# EAGLE design JOYSW (EAGLE 9.2.2)
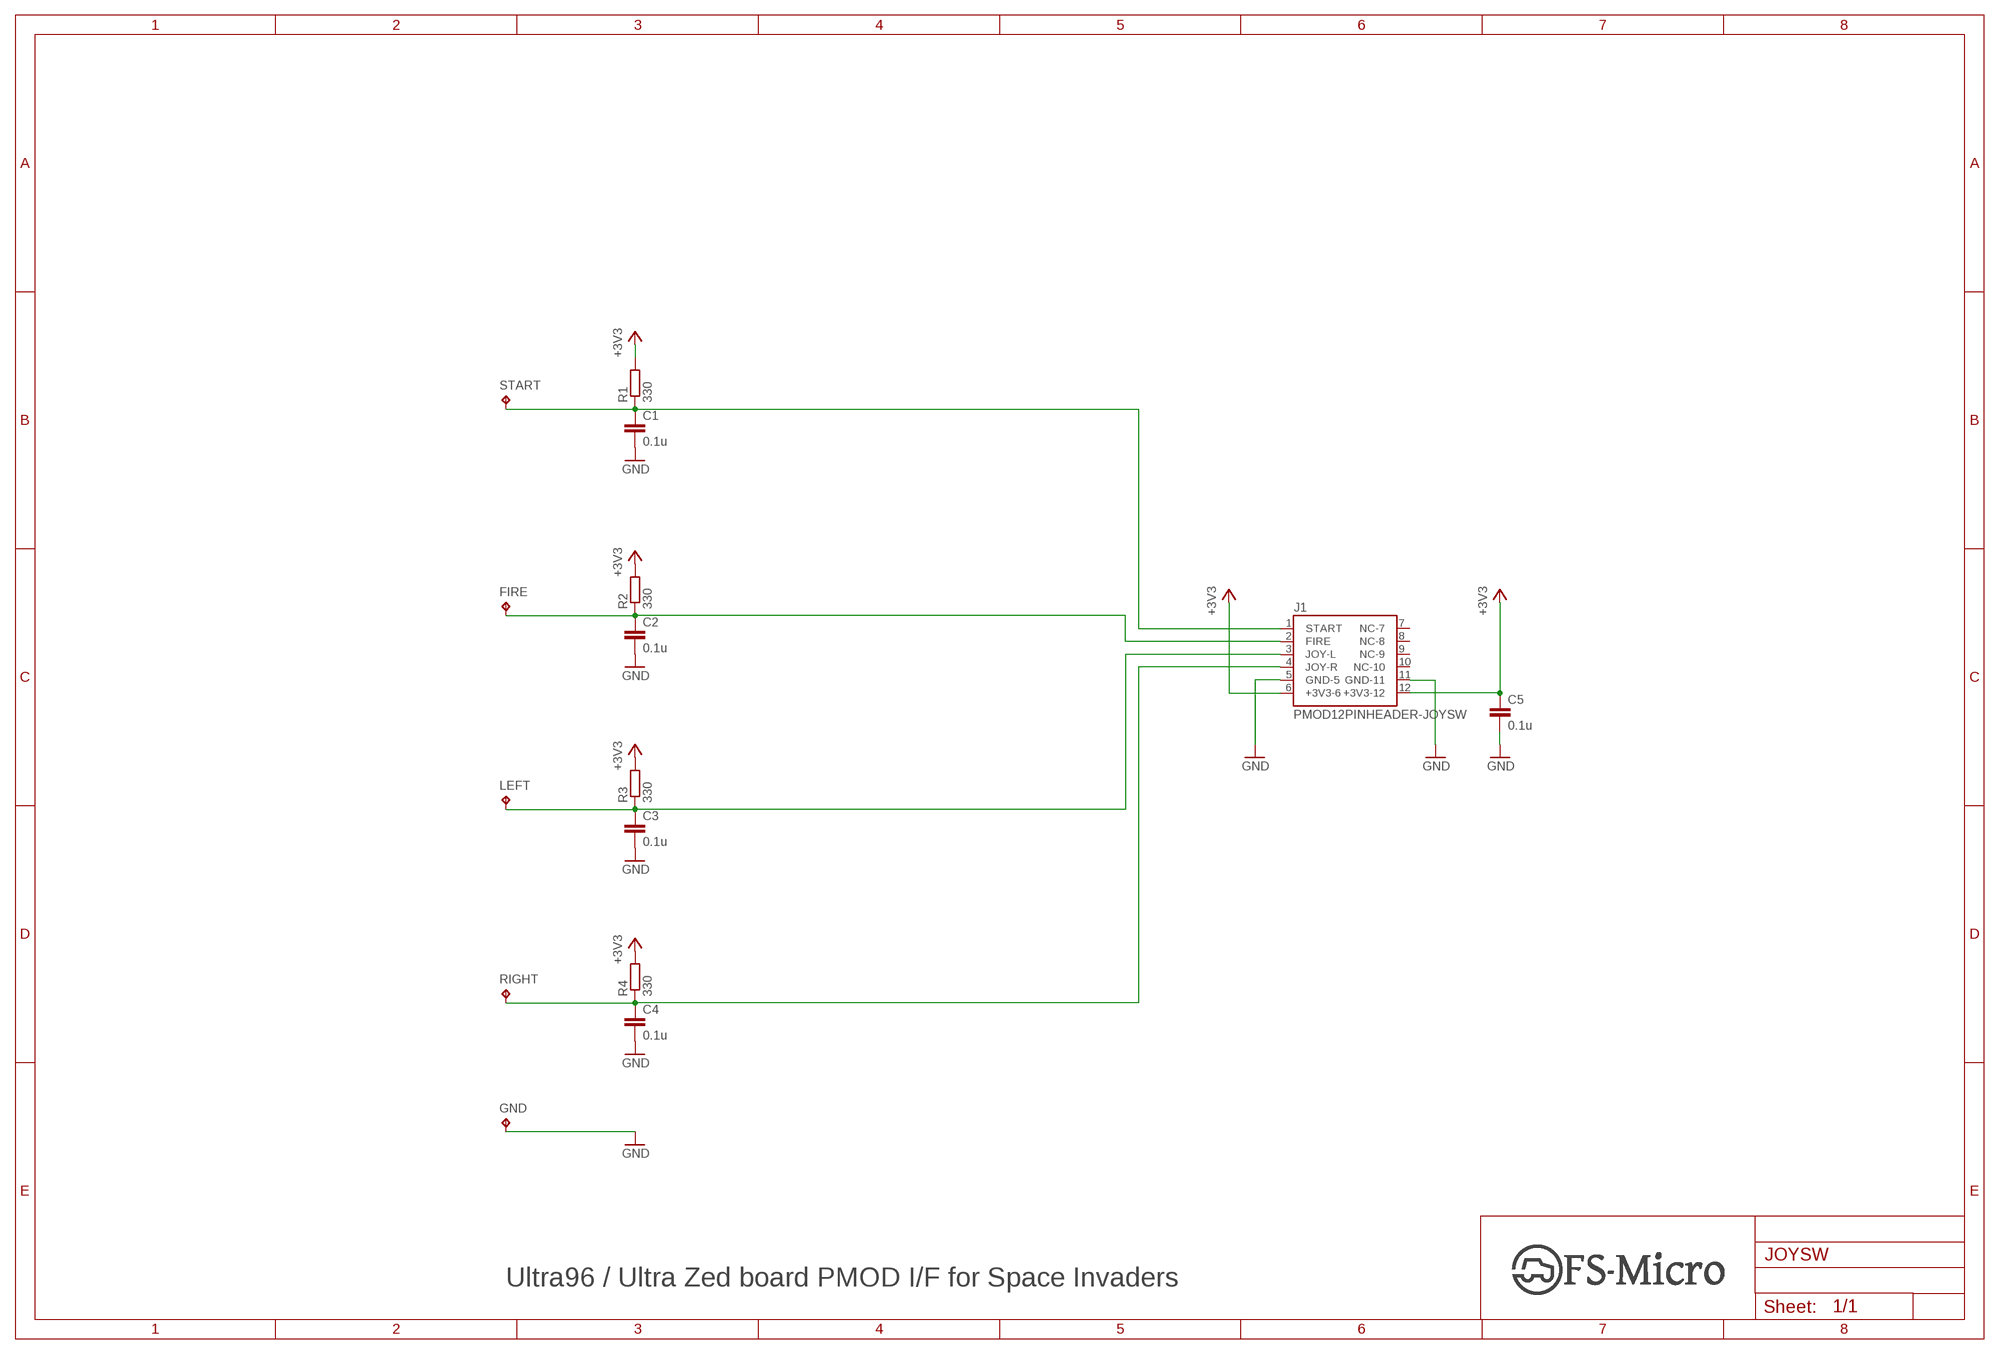
[diagram p0: schematic, sheet 1]

## Parts
C1  0.1u  C-EU050-025X075  [C050-025X075]
C2  0.1u  C-EU050-025X075  [C050-025X075]
C3  0.1u  C-EU050-025X075  [C050-025X075]
C4  0.1u  C-EU050-025X075  [C050-025X075]
C5  0.1u  C-EU050-025X075  [C050-025X075]
FIRE  TPPAD1-13  [P1-13]
GND  TPPAD1-13  [P1-13]
J1  PMOD12PINHEADER-JOYSW  [PMOD12PINHEADER]
LEFT  TPPAD1-13  [P1-13]
R1  330  R-EU_0207/7  [0207/7]
R2  330  R-EU_0207/7  [0207/7]
R3  330  R-EU_0207/7  [0207/7]
R4  330  R-EU_0207/7  [0207/7]
RIGHT  TPPAD1-13  [P1-13]
START  TPPAD1-13  [P1-13]

## Nets
+3V3 [+3V3]: C5.1 J1.6(+3V3-6) J1.12(+3V3-12) R1.2 R2.2 R3.2 R4.2
FIRE: C2.1 FIRE.TP J1.2(FIRE) R2.1
GND [GND]: C1.2 C2.2 C3.2 C4.2 C5.2 GND.TP J1.5(GND-5) J1.11(GND-11)
JOY-L: C3.1 J1.3(JOY-L) LEFT.TP R3.1
JOY-R: C4.1 J1.4(JOY-R) R4.1 RIGHT.TP
START: C1.1 J1.1(START) R1.1 START.TP
Unconnected: J1.7(NC-7) J1.8(NC-8) J1.9(NC-9) J1.10(NC-10)

## Notes on the sheet
- Ultra96 / Ultra Zed board PMOD I/F for Space Invaders

## Library data of the parts
C1-C5 = rcl:C-EU: CAPACITOR, European symbol
FIRE GND LEFT RIGHT START = testpad:TP: Test pad
J1 = mylib:PMOD12PINHEADER-JOYSW
R1-R4 = rcl:R-EU_: RESISTOR, European symbol; SPICEPREFIX: R

## Net classes
0 default: width 0.152 mm, drill 0.254 mm, clearance 0.152 mm
1 GND: width 0.305 mm, drill 0.254 mm, clearance 0.152 mm
2 SYS_DCIN: width 0.508 mm, drill 0.254 mm, clearance 0.152 mm
3 +3V3: width 0.508 mm, drill 0.254 mm, clearance 0.152 mm
4 +1V8: width 0.508 mm, drill 0.254 mm, clearance 0.152 mm

## Board
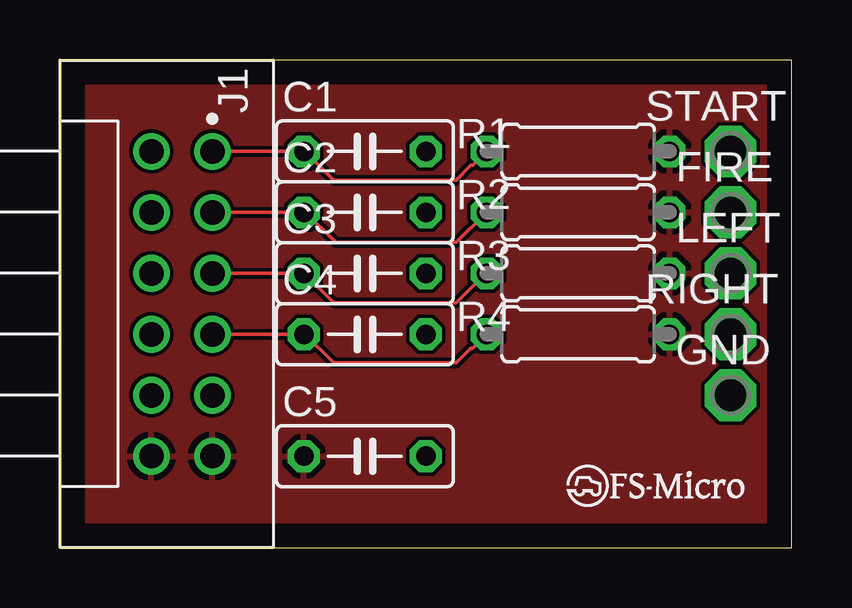
[diagram p1: board, top side]
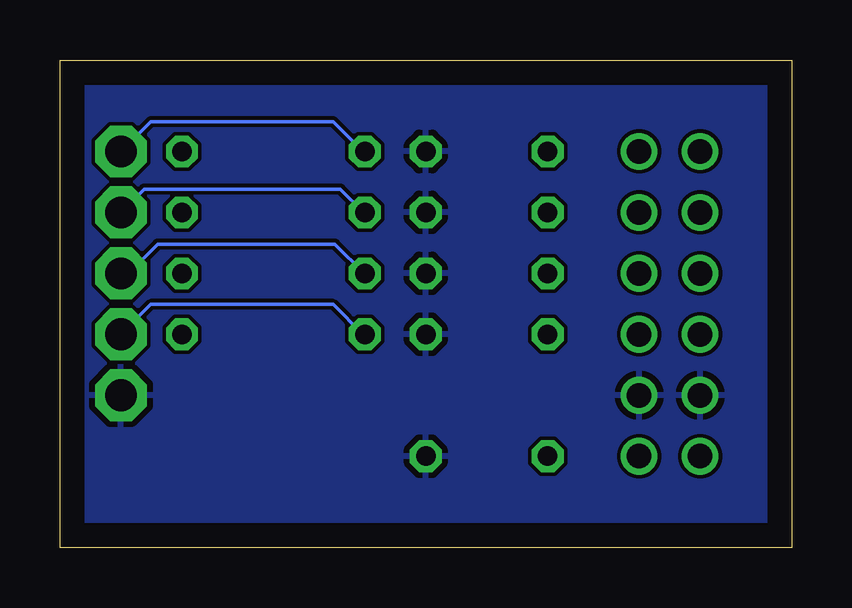
[diagram p2: board, bottom side, seen from below]

Size 30.48 x 20.32 mm. Coordinates in mm from the lower left corner, seen from the top.
Outline: 0,0 30.48,0 30.48,20.32 0,20.32 0,0
Copper layers (1*16): Top 0.035mm / dielectric 1.5mm / Bottom 0.035mm
Design rules "default": minimum track width 6mil, minimum drill 0.35mm, track to track 6mil, track to pad 6mil, pad to pad 6mil, via to via 6mil, smd to smd 6mil, copper to edge 40mil, drill to drill 6mil, minimum pad ring 10mil, minimum via ring 8mil, stop-mask expansion 4mil, vias tented up to drill 0mil, thermal gap 10mil

### Footprints (pad centres in the part's own frame; a part is rotated, then mirrored left to right if it is on the bottom)
C050-025X075 = drill 0.813 octagon: 1 -2.54,0; 2 2.54,0
P1-13 = drill 1.321 pad 2.159 octagon: TP 0,0
PMOD12PINHEADER = drill 1.02: 1 0,0; 2 2.54,0; 3 5.08,0; 4 7.62,0; 5 10.16,0; 6 12.7,0; 7 0,-2.54; 8 2.54,-2.54; 9 5.08,-2.54; 10 7.62,-2.54; 11 10.16,-2.54; 12 12.7,-2.54
0207/7 = drill 0.813 octagon: 1 -3.81,0; 2 3.81,0

### Placement (x,y rotation side)
C1  12.7,16.51 0 top
C2  12.7,13.97 0 top
C3  12.7,11.43 0 top
C4  12.7,8.89 0 top
C5  12.7,3.81 0 top
FIRE  27.94,13.97 0 top
GND  27.94,6.35 0 top
J1  6.35,16.51 270 top
LEFT  27.94,11.43 0 top
R1  21.59,16.51 0 top
R2  21.59,13.97 0 top
R3  21.59,11.43 0 top
R4  21.59,8.89 0 top
RIGHT  27.94,8.89 0 top
START  27.94,16.51 0 top

### Tracks (layer width: path | path; a pad name or v marks a point on that pad's centre or on a via)
+3V3
  pour Top: 0,20.32 0,0 30.48,0 30.48,20.32
FIRE
  Top 0.152: R2.1 17.73,13.95 16.51,12.72 11.48,12.72 10.19,14.02 C2.1 J1.2
  Bottom 0.152: R2.1 17.83,13.97 18.8,14.94 26.98,14.94 FIRE.TP
GND
  pour Bottom: 0,20.32 0,0 30.48,0 30.48,20.32
JOY-L
  Top 0.152: R3.1 17.73,11.43 16.51,10.21 11.4,10.21 10.19,11.43 C3.1 J1.3
  Bottom 0.152: LEFT.TP 27.64,11.43 26.42,12.65 19.02,12.65 17.8,11.43 R3.1
JOY-R
  Top 0.152: R4.1 17.2,8.31 17.12,8.31 16.51,7.7 11.4,7.7 10.19,8.91 C4.1 J1.4
  Bottom 0.152: R4.1 17.86,8.89 19.1,10.13 26.7,10.13 RIGHT.TP
START
  Top 0.152: R1.1 17.2,15.93 17.12,15.93 16.51,15.32 11.4,15.32 10.19,16.54 C1.1 J1.1
  Bottom 0.152: R1.1 17.86,16.51 19.1,17.75 26.7,17.75 START.TP